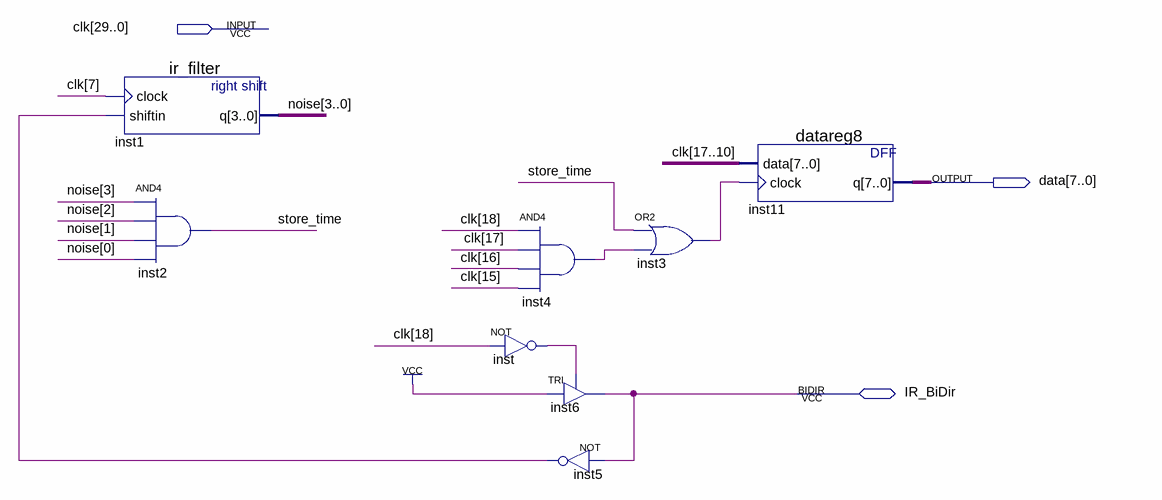
[diagram p0: schematic sheet]
// Quartus schematic IR_Sensor.bdf as structural Verilog: 8 symbols, 3 pins
module IR_Sensor (
  input  [29:0] clk,
  inout  IR_BiDir,
  output [7:0] data
);

  wire inst3_out, inst4_out, inst5_out, inst_out, store_time;
  wire [3:0] noise;

  ir_filter inst1 (.clock(clk[7]), .shiftin(inst5_out), .q(noise));
  and inst2 (store_time, noise[3], noise[2], noise[1], noise[0]);
  and inst4 (inst4_out, clk[18], clk[17], clk[16], clk[15]);
  not inst (inst_out, clk[18]);
  TRI inst6 (.IN(1'b1), .OE(inst_out), .OUT(IR_BiDir));
  not inst5 (inst5_out, IR_BiDir);
  or inst3 (inst3_out, store_time, inst4_out);
  datareg8 inst11 (.data(clk[17:10]), .clock(inst3_out), .q(data));
endmodule
